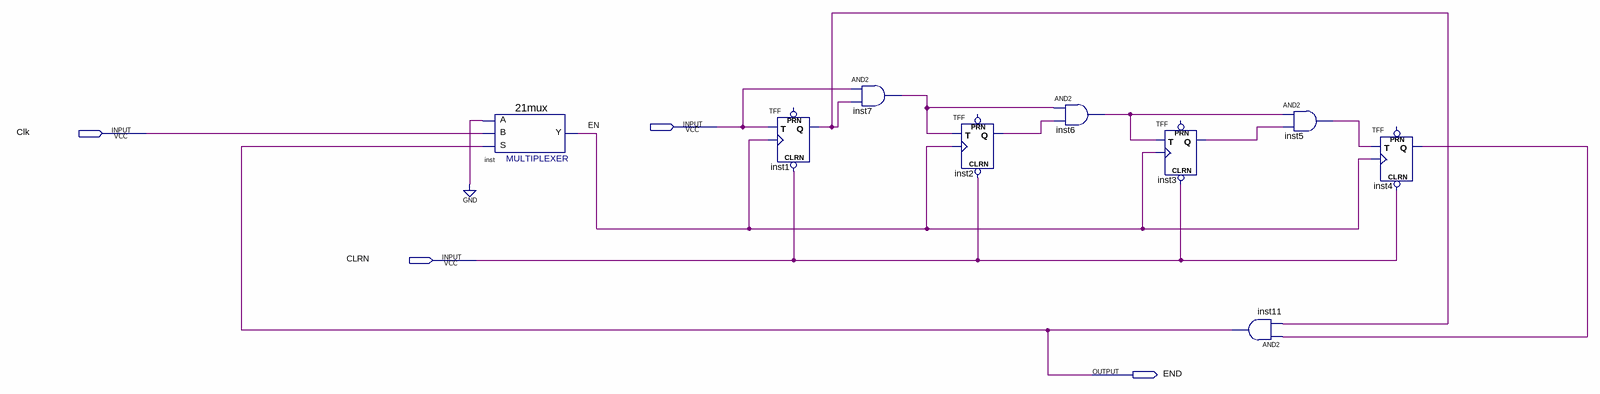
[diagram p0: schematic sheet]
// Quartus schematic counter.bdf as structural Verilog: 9 symbols, 4 pins
module counter (
  input  EN,
  input  Clk,
  input  CLRN,
  output END
);

  wire inst1_q, inst2_q, inst3_q, inst4_q, inst5_out, inst6_out, inst7_out, inst_y;

  \21mux  inst (.S(END), .B(Clk), .A(1'b0), .Y(inst_y));
  TFF inst1 (.CLRN(CLRN), .T(EN), .CLK(inst_y), .Q(inst1_q));  // open: PRN
  and inst7 (inst7_out, EN, inst1_q);
  TFF inst2 (.CLRN(CLRN), .T(inst7_out), .CLK(inst_y), .Q(inst2_q));  // open: PRN
  and inst6 (inst6_out, inst7_out, inst2_q);
  TFF inst3 (.CLRN(CLRN), .T(inst6_out), .CLK(inst_y), .Q(inst3_q));  // open: PRN
  and inst11 (END, inst4_q, inst1_q);
  and inst5 (inst5_out, inst6_out, inst3_q);
  TFF inst4 (.CLRN(CLRN), .T(inst5_out), .CLK(inst_y), .Q(inst4_q));  // open: PRN
endmodule
